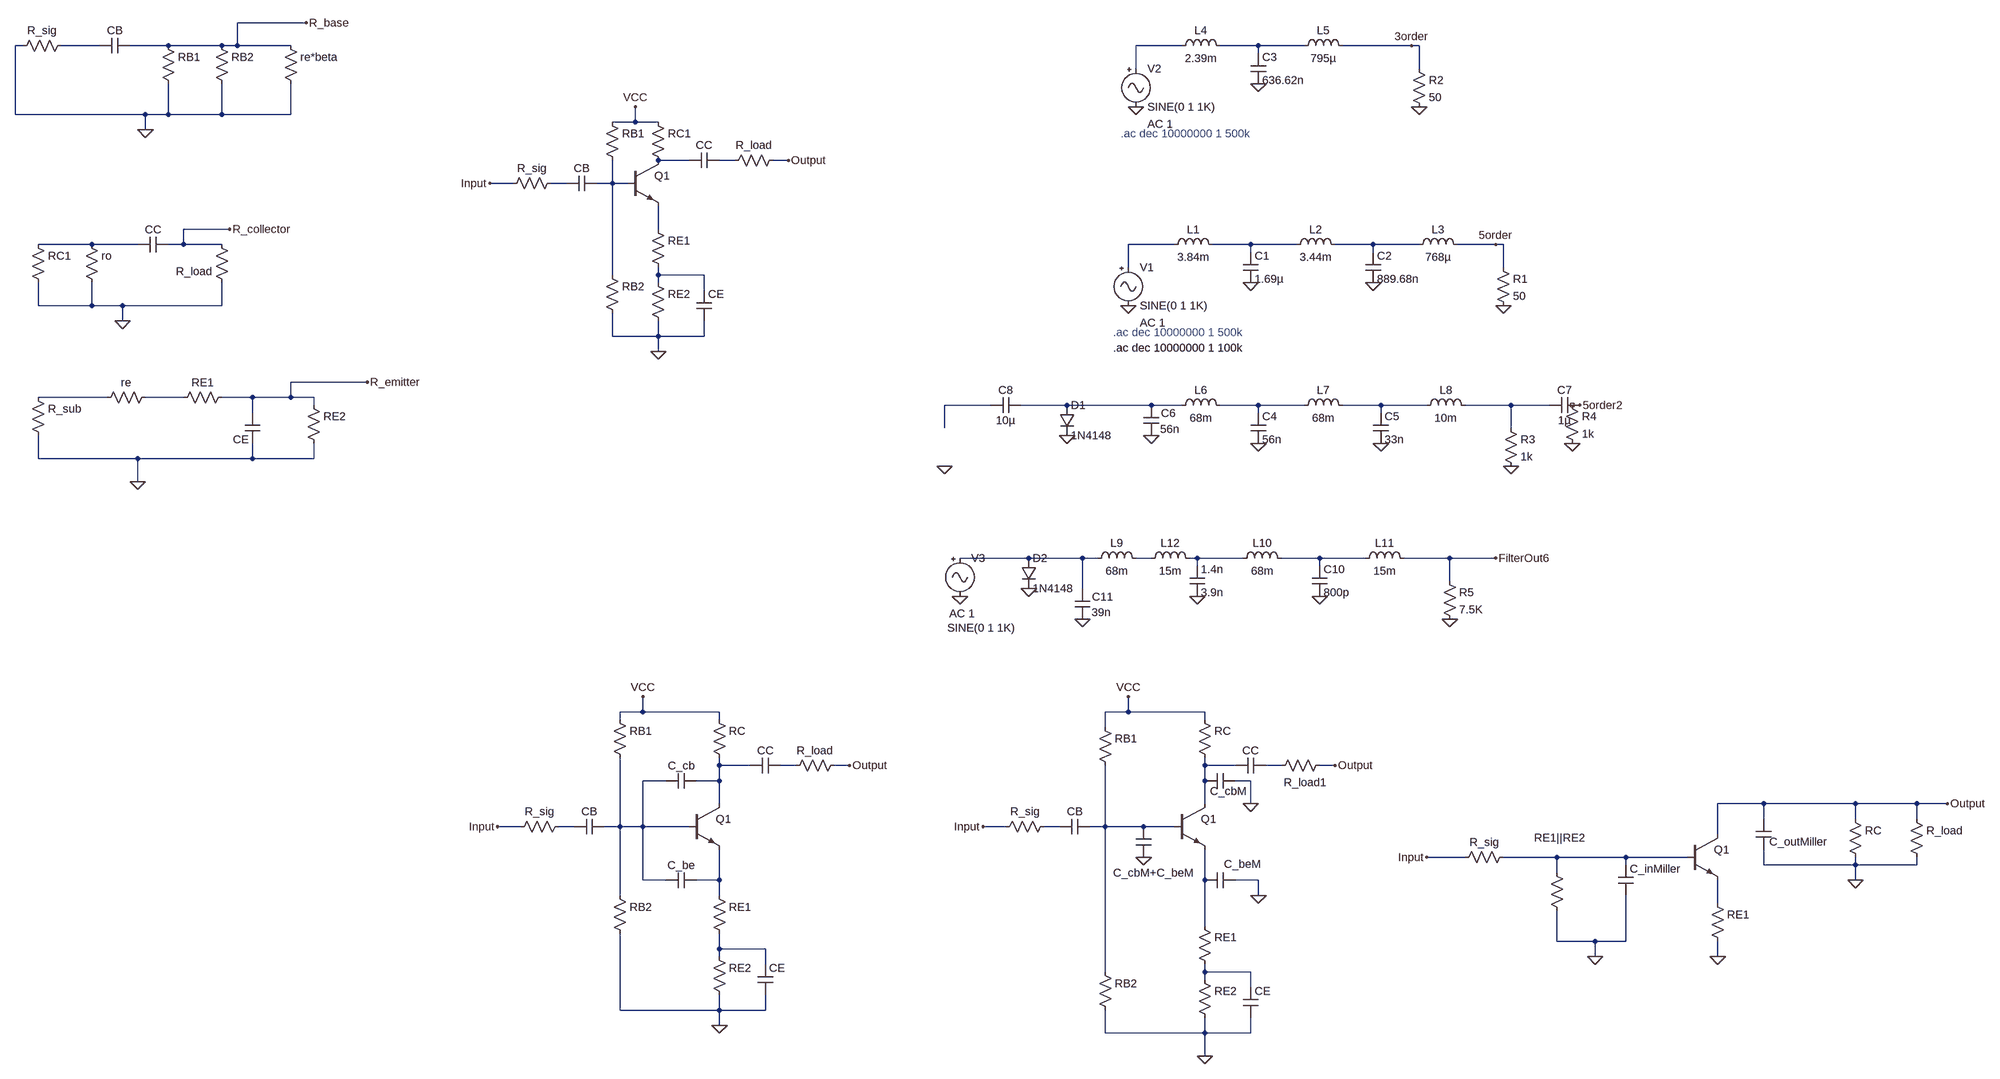
[diagram p0: schematic filtersForMixer.asc]
filtersForMixer.asc, the LTspice schematic file:
Version 4
SHEET 1 1812 1892
WIRE -1792 -320 -1936 -320
WIRE -2384 -272 -2400 -272
WIRE -2224 -272 -2304 -272
WIRE -2080 -272 -2160 -272
WIRE -1968 -272 -2080 -272
WIRE -1936 -272 -1936 -320
WIRE -1936 -272 -1968 -272
WIRE -1824 -272 -1936 -272
WIRE 112 -272 16 -272
WIRE 272 -272 192 -272
WIRE 368 -272 272 -272
WIRE 592 -272 448 -272
WIRE 608 -272 592 -272
WIRE 272 -256 272 -272
WIRE 16 -224 16 -272
WIRE 608 -224 608 -272
WIRE -2400 -128 -2400 -272
WIRE -2128 -128 -2400 -128
WIRE -2080 -128 -2080 -192
WIRE -2080 -128 -2128 -128
WIRE -1968 -128 -1968 -192
WIRE -1968 -128 -2080 -128
WIRE -1824 -128 -1824 -192
WIRE -1824 -128 -1968 -128
WIRE -1104 -112 -1104 -144
WIRE -1104 -112 -1152 -112
WIRE -1056 -112 -1104 -112
WIRE -2128 -96 -2128 -128
WIRE -992 -32 -1056 -32
WIRE -896 -32 -928 -32
WIRE -784 -32 -816 -32
WIRE -1360 16 -1408 16
WIRE -1248 16 -1280 16
WIRE -1152 16 -1152 -32
WIRE -1152 16 -1184 16
WIRE -1120 16 -1152 16
WIRE -1952 112 -2048 112
WIRE -1056 112 -1056 64
WIRE -2240 144 -2352 144
WIRE -2144 144 -2240 144
WIRE -2048 144 -2048 112
WIRE -2048 144 -2080 144
WIRE -1968 144 -2048 144
WIRE 96 144 0 144
WIRE 256 144 176 144
WIRE 352 144 256 144
WIRE 512 144 432 144
WIRE 608 144 512 144
WIRE 768 144 688 144
WIRE 784 144 768 144
WIRE 256 160 256 144
WIRE 512 160 512 144
WIRE 0 192 0 144
WIRE 784 192 784 144
WIRE -1152 208 -1152 16
WIRE -1056 208 -1056 192
WIRE -960 208 -1056 208
WIRE -1056 224 -1056 208
WIRE -960 240 -960 208
WIRE -2352 272 -2352 224
WIRE -2240 272 -2240 224
WIRE -2240 272 -2352 272
WIRE -2176 272 -2240 272
WIRE -1968 272 -1968 224
WIRE -1968 272 -2176 272
WIRE -2176 304 -2176 272
WIRE -1152 336 -1152 288
WIRE -1056 336 -1056 304
WIRE -1056 336 -1152 336
WIRE -960 336 -960 304
WIRE -960 336 -1056 336
WIRE -1056 368 -1056 336
WIRE -1664 432 -1824 432
WIRE -2208 464 -2352 464
WIRE -2048 464 -2128 464
WIRE -1904 464 -1968 464
WIRE -1824 464 -1824 432
WIRE -1824 464 -1904 464
WIRE -1776 464 -1824 464
WIRE -1776 480 -1776 464
WIRE -288 480 -384 480
WIRE -128 480 -224 480
WIRE 48 480 -128 480
WIRE 112 480 48 480
WIRE 272 480 192 480
WIRE 368 480 272 480
WIRE 528 480 448 480
WIRE 624 480 528 480
WIRE 800 480 704 480
WIRE 880 480 800 480
WIRE -1904 496 -1904 464
WIRE 272 496 272 480
WIRE 528 496 528 480
WIRE -384 528 -384 480
WIRE 800 528 800 480
WIRE -2352 592 -2352 544
WIRE -2144 592 -2352 592
WIRE -1904 592 -1904 560
WIRE -1904 592 -2144 592
WIRE -1776 592 -1776 560
WIRE -1776 592 -1904 592
WIRE -2144 640 -2144 592
WIRE -208 800 -352 800
WIRE -96 800 -208 800
WIRE -64 800 -96 800
WIRE 48 800 16 800
WIRE 144 800 128 800
WIRE 240 800 144 800
WIRE 400 800 320 800
WIRE 496 800 400 800
WIRE 672 800 576 800
WIRE 768 800 672 800
WIRE 144 816 144 800
WIRE 400 816 400 800
WIRE 672 848 672 800
WIRE -96 864 -96 800
WIRE -1088 1152 -1088 1120
WIRE -1088 1152 -1136 1152
WIRE -928 1152 -1088 1152
WIRE 0 1152 0 1120
WIRE 0 1152 -48 1152
WIRE 160 1152 0 1152
WIRE -1136 1168 -1136 1152
WIRE -928 1168 -928 1152
WIRE 160 1168 160 1152
WIRE -48 1184 -48 1152
WIRE -928 1264 -928 1248
WIRE -864 1264 -928 1264
WIRE -768 1264 -800 1264
WIRE -656 1264 -688 1264
WIRE 160 1264 160 1248
WIRE 224 1264 160 1264
WIRE 320 1264 288 1264
WIRE 432 1264 400 1264
WIRE -1040 1296 -1088 1296
WIRE -928 1296 -928 1264
WIRE -928 1296 -976 1296
WIRE 160 1296 160 1264
WIRE 256 1296 224 1296
WIRE -928 1344 -928 1296
WIRE 160 1344 160 1296
WIRE 256 1344 256 1296
WIRE 1328 1344 1232 1344
WIRE 1520 1344 1328 1344
WIRE 1648 1344 1520 1344
WIRE 1712 1344 1648 1344
WIRE 1328 1376 1328 1344
WIRE 1520 1376 1520 1344
WIRE 1648 1376 1648 1344
WIRE -1344 1392 -1392 1392
WIRE -1232 1392 -1264 1392
WIRE -1136 1392 -1136 1248
WIRE -1136 1392 -1168 1392
WIRE -1088 1392 -1088 1296
WIRE -1088 1392 -1136 1392
WIRE -992 1392 -1088 1392
WIRE -256 1392 -304 1392
WIRE -144 1392 -176 1392
WIRE -48 1392 -48 1264
WIRE -48 1392 -80 1392
WIRE 32 1392 -48 1392
WIRE 96 1392 32 1392
WIRE 1232 1408 1232 1344
WIRE 704 1456 624 1456
WIRE 896 1456 784 1456
WIRE 1040 1456 896 1456
WIRE 1168 1456 1040 1456
WIRE 1040 1472 1040 1456
WIRE 1328 1472 1328 1440
WIRE 1520 1472 1520 1456
WIRE 1520 1472 1328 1472
WIRE 1648 1472 1648 1456
WIRE 1648 1472 1520 1472
WIRE 896 1488 896 1456
WIRE -1088 1504 -1088 1392
WIRE -1040 1504 -1088 1504
WIRE -928 1504 -928 1440
WIRE -928 1504 -976 1504
WIRE 160 1504 160 1440
WIRE 272 1504 224 1504
WIRE 1520 1504 1520 1472
WIRE -1136 1536 -1136 1392
WIRE -928 1536 -928 1504
WIRE 272 1536 272 1504
WIRE 1232 1552 1232 1504
WIRE 160 1600 160 1504
WIRE 896 1632 896 1568
WIRE 976 1632 896 1632
WIRE 1040 1632 1040 1536
WIRE 1040 1632 976 1632
WIRE -928 1648 -928 1616
WIRE -832 1648 -928 1648
WIRE -928 1664 -928 1648
WIRE 976 1664 976 1632
WIRE 1232 1664 1232 1632
WIRE -832 1680 -832 1648
WIRE -48 1696 -48 1392
WIRE 160 1696 160 1680
WIRE 256 1696 160 1696
WIRE 160 1712 160 1696
WIRE 256 1728 256 1696
WIRE -1136 1776 -1136 1616
WIRE -928 1776 -928 1744
WIRE -928 1776 -1136 1776
WIRE -832 1776 -832 1744
WIRE -832 1776 -928 1776
WIRE -928 1808 -928 1776
WIRE -48 1824 -48 1776
WIRE 160 1824 160 1792
WIRE 160 1824 -48 1824
WIRE 256 1824 256 1792
WIRE 256 1824 160 1824
WIRE 160 1872 160 1824
FLAG 512 224 0
FLAG 256 224 0
FLAG 784 272 0
FLAG 0 272 0
FLAG 272 -192 0
FLAG 608 -144 0
FLAG 16 -144 0
FLAG 592 -272 3order
FLAG 768 144 5order
FLAG 528 560 0
FLAG 272 560 0
FLAG 928 560 0
FLAG 944 480 5order2
FLAG -128 544 0
FLAG 48 544 0
FLAG -384 608 0
FLAG 800 608 0
FLAG 768 800 FilterOut6
FLAG 400 880 0
FLAG 144 880 0
FLAG 672 928 0
FLAG -208 864 0
FLAG -352 880 0
FLAG -1104 -144 VCC
FLAG -784 -32 Output
FLAG -1408 16 Input
FLAG -1056 368 0
FLAG -1792 -320 R_base
FLAG -2176 304 0
FLAG -2128 -96 0
FLAG -1952 112 R_collector
FLAG -2144 640 0
FLAG -1664 432 R_emitter
FLAG -1088 1120 VCC
FLAG -656 1264 Output
FLAG -1392 1392 Input
FLAG -928 1808 0
FLAG 0 1120 VCC
FLAG 432 1264 Output
FLAG 32 1456 0
FLAG 272 1536 0
FLAG -304 1392 Input
FLAG 160 1872 0
FLAG 256 1344 0
FLAG 976 1664 0
FLAG 1520 1504 0
FLAG 1712 1344 Output
FLAG 624 1456 Input
FLAG 1232 1664 0
FLAG -96 928 0
SYMBOL ind 80 160 R270
WINDOW 0 32 56 VTop 2
WINDOW 3 5 56 VBottom 2
SYMATTR InstName L1
SYMATTR Value 3.84m
SYMBOL ind 336 160 R270
WINDOW 0 32 56 VTop 2
WINDOW 3 5 56 VBottom 2
SYMATTR InstName L2
SYMATTR Value 3.44m
SYMBOL cap 240 160 R0
SYMATTR InstName C1
SYMATTR Value 1.69µ
SYMBOL cap 496 160 R0
SYMATTR InstName C2
SYMATTR Value 889.68n
SYMBOL ind 592 160 R270
WINDOW 0 32 56 VTop 2
WINDOW 3 5 56 VBottom 2
SYMATTR InstName L3
SYMATTR Value 768µ
SYMBOL res 768 176 R0
SYMATTR InstName R1
SYMATTR Value 50
SYMBOL Misc\\signal 0 176 R0
WINDOW 123 24 132 Left 2
WINDOW 39 0 0 Left 0
SYMATTR Value2 AC 1
SYMATTR InstName V1
SYMBOL ind 96 -256 R270
WINDOW 0 32 56 VTop 2
WINDOW 3 5 56 VBottom 2
SYMATTR InstName L4
SYMATTR Value 2.39m
SYMBOL ind 352 -256 R270
WINDOW 0 32 56 VTop 2
WINDOW 3 5 56 VBottom 2
SYMATTR InstName L5
SYMATTR Value 795µ
SYMBOL cap 256 -256 R0
SYMATTR InstName C3
SYMATTR Value 636.62n
SYMBOL res 592 -240 R0
SYMATTR InstName R2
SYMATTR Value 50
SYMBOL Misc\\signal 16 -240 R0
WINDOW 123 24 132 Left 2
WINDOW 39 0 0 Left 0
SYMATTR Value2 AC 1
SYMATTR InstName V2
SYMBOL ind 96 496 R270
WINDOW 0 32 56 VTop 2
WINDOW 3 5 56 VBottom 2
SYMATTR InstName L6
SYMATTR Value 68m
SYMBOL ind 352 496 R270
WINDOW 0 32 56 VTop 2
WINDOW 3 5 56 VBottom 2
SYMATTR InstName L7
SYMATTR Value 68m
SYMBOL cap 256 496 R0
SYMATTR InstName C4
SYMATTR Value 56n
SYMBOL cap 512 496 R0
SYMATTR InstName C5
SYMATTR Value 33n
SYMBOL ind 608 496 R270
WINDOW 0 32 56 VTop 2
WINDOW 3 5 56 VBottom 2
SYMATTR InstName L8
SYMATTR Value 10m
SYMBOL res 784 512 R0
SYMATTR InstName R3
SYMATTR Value 1k
SYMBOL diode -144 480 R0
SYMATTR InstName D1
SYMATTR Value 1N4148
SYMBOL cap 32 480 R0
WINDOW 0 36 17 Left 2
WINDOW 3 35 50 Left 2
SYMATTR InstName C6
SYMATTR Value 56n
SYMBOL Misc\\signal -352 784 R0
WINDOW 123 -22 132 Left 2
WINDOW 39 0 0 Left 0
WINDOW 3 -26 162 Left 2
SYMATTR Value2 AC 1
SYMATTR InstName V3
SYMBOL cap 944 464 R90
WINDOW 0 0 32 VBottom 2
WINDOW 3 32 32 VTop 2
SYMATTR InstName C7
SYMATTR Value 1µ
SYMBOL res 912 464 R0
SYMATTR InstName R4
SYMATTR Value 1k
SYMBOL cap -224 464 R90
WINDOW 0 0 32 VBottom 2
WINDOW 3 32 32 VTop 2
SYMATTR InstName C8
SYMATTR Value 10µ
SYMBOL ind -80 816 R270
WINDOW 0 32 56 VTop 2
WINDOW 3 5 56 VBottom 2
SYMATTR InstName L9
SYMATTR Value 68m
SYMBOL ind 224 816 R270
WINDOW 0 32 56 VTop 2
WINDOW 3 5 56 VBottom 2
SYMATTR InstName L10
SYMATTR Value 68m
SYMBOL cap 128 816 R0
SYMATTR InstName 1.4n
SYMATTR Value 3.9n
SYMBOL cap 384 816 R0
SYMATTR InstName C10
SYMATTR Value 800p
SYMBOL ind 480 816 R270
WINDOW 0 32 56 VTop 2
WINDOW 3 5 56 VBottom 2
SYMATTR InstName L11
SYMATTR Value 15m
SYMBOL res 656 832 R0
SYMATTR InstName R5
SYMATTR Value 7.5K
SYMBOL diode -224 800 R0
SYMATTR InstName D2
SYMATTR Value 1N4148
SYMBOL cap -112 864 R0
WINDOW 0 36 17 Left 2
WINDOW 3 35 50 Left 2
SYMATTR InstName C11
SYMATTR Value 39n
SYMBOL npn -1120 -32 R0
SYMATTR InstName Q1
SYMATTR Value ""
SYMBOL res -1072 -128 R0
SYMATTR InstName RC1
SYMATTR Value ""
SYMBOL res -1168 -128 R0
SYMATTR InstName RB1
SYMATTR Value ""
SYMBOL cap -928 -48 R90
WINDOW 0 0 32 VBottom 2
WINDOW 3 32 32 VTop 2
SYMATTR InstName CC
SYMATTR Value ""
SYMBOL cap -1184 0 R90
WINDOW 0 0 32 VBottom 2
WINDOW 3 32 32 VTop 2
SYMATTR InstName CB
SYMATTR Value ""
SYMBOL res -1072 208 R0
SYMATTR InstName RE2
SYMATTR Value ""
SYMBOL res -1168 192 R0
SYMATTR InstName RB2
SYMATTR Value ""
SYMBOL cap -976 240 R0
SYMATTR InstName CE
SYMATTR Value ""
SYMBOL res -1072 96 R0
SYMATTR InstName RE1
SYMATTR Value ""
SYMBOL res -1264 0 R90
WINDOW 0 0 56 VBottom 2
WINDOW 3 32 56 VTop 2
SYMATTR InstName R_sig
SYMATTR Value ""
SYMBOL res -800 -48 R90
WINDOW 0 0 56 VBottom 2
WINDOW 3 32 56 VTop 2
SYMATTR InstName R_load
SYMATTR Value ""
SYMBOL res -2288 -288 R90
WINDOW 0 0 56 VBottom 2
WINDOW 3 32 56 VTop 2
SYMATTR InstName R_sig
SYMATTR Value ""
SYMBOL cap -2160 -288 R90
WINDOW 0 0 32 VBottom 2
WINDOW 3 32 32 VTop 2
SYMATTR InstName CB
SYMATTR Value ""
SYMBOL res -2096 -288 R0
SYMATTR InstName RB1
SYMATTR Value ""
SYMBOL res -1984 -288 R0
SYMATTR InstName RB2
SYMATTR Value ""
SYMBOL res -1840 -288 R0
SYMATTR InstName re*beta
SYMATTR Value ""
SYMBOL res -2368 128 R0
SYMATTR InstName RC1
SYMATTR Value ""
SYMBOL res -2256 128 R0
SYMATTR InstName ro
SYMATTR Value ""
SYMBOL cap -2080 128 R90
WINDOW 0 0 32 VBottom 2
WINDOW 3 32 32 VTop 2
SYMATTR InstName CC
SYMATTR Value ""
SYMBOL res -1952 240 R180
WINDOW 3 36 19 Left 2
SYMATTR Value ""
SYMATTR InstName R_load
SYMBOL res -2368 448 R0
SYMATTR InstName R_sub
SYMATTR Value ""
SYMBOL res -2112 448 R90
WINDOW 0 0 56 VBottom 2
WINDOW 3 32 56 VTop 2
SYMATTR InstName re
SYMATTR Value ""
SYMBOL res -2064 480 R270
WINDOW 0 32 56 VTop 2
WINDOW 3 0 56 VBottom 2
SYMATTR InstName RE1
SYMATTR Value ""
SYMBOL cap -1888 560 R180
WINDOW 3 24 -13 Left 2
SYMATTR Value ""
SYMATTR InstName CE
SYMBOL npn -992 1344 R0
SYMATTR InstName Q1
SYMATTR Value ""
SYMBOL res -944 1152 R0
SYMATTR InstName RC
SYMATTR Value ""
SYMBOL cap -800 1248 R90
WINDOW 0 0 32 VBottom 2
WINDOW 3 32 32 VTop 2
SYMATTR InstName CC
SYMATTR Value ""
SYMBOL cap -1168 1376 R90
WINDOW 0 0 32 VBottom 2
WINDOW 3 32 32 VTop 2
SYMATTR InstName CB
SYMATTR Value ""
SYMBOL res -944 1648 R0
SYMATTR InstName RE2
SYMATTR Value ""
SYMBOL res -1152 1520 R0
SYMATTR InstName RB2
SYMATTR Value ""
SYMBOL cap -848 1680 R0
SYMATTR InstName CE
SYMATTR Value ""
SYMBOL res -944 1520 R0
SYMATTR InstName RE1
SYMATTR Value ""
SYMBOL res -1248 1376 R90
WINDOW 0 0 56 VBottom 2
WINDOW 3 32 56 VTop 2
SYMATTR InstName R_sig
SYMATTR Value ""
SYMBOL res -672 1248 R90
WINDOW 0 0 56 VBottom 2
WINDOW 3 32 56 VTop 2
SYMATTR InstName R_load
SYMATTR Value ""
SYMBOL cap -976 1280 R90
WINDOW 0 0 32 VBottom 2
WINDOW 3 32 32 VTop 2
SYMATTR InstName C_cb
SYMATTR Value ""
SYMBOL cap -976 1488 R90
WINDOW 0 0 32 VBottom 2
WINDOW 3 32 32 VTop 2
SYMATTR InstName C_be
SYMATTR Value ""
SYMBOL res -1152 1152 R0
SYMATTR InstName RB1
SYMATTR Value ""
SYMBOL npn 96 1344 R0
SYMATTR InstName Q1
SYMATTR Value ""
SYMBOL res 144 1152 R0
SYMATTR InstName RC
SYMATTR Value ""
SYMBOL cap 288 1248 R90
WINDOW 0 0 32 VBottom 2
WINDOW 3 32 32 VTop 2
SYMATTR InstName CC
SYMATTR Value ""
SYMBOL cap -80 1376 R90
WINDOW 0 0 32 VBottom 2
WINDOW 3 32 32 VTop 2
SYMATTR InstName CB
SYMATTR Value ""
SYMBOL res 144 1696 R0
SYMATTR InstName RE2
SYMATTR Value ""
SYMBOL res -64 1680 R0
SYMATTR InstName RB2
SYMATTR Value ""
SYMBOL cap 240 1728 R0
SYMATTR InstName CE
SYMATTR Value ""
SYMBOL res 144 1584 R0
SYMATTR InstName RE1
SYMATTR Value ""
SYMBOL res -160 1376 R90
WINDOW 0 0 56 VBottom 2
WINDOW 3 32 56 VTop 2
SYMATTR InstName R_sig
SYMATTR Value ""
SYMBOL res 416 1248 R90
WINDOW 0 67 46 VBottom 2
WINDOW 3 32 56 VTop 2
SYMATTR InstName R_load1
SYMATTR Value ""
SYMBOL res -64 1168 R0
SYMATTR InstName RB1
SYMATTR Value ""
SYMBOL cap 16 1392 R0
WINDOW 0 -48 97 Left 2
SYMATTR InstName C_cbM+C_beM
SYMATTR Value ""
SYMBOL cap 224 1488 R90
WINDOW 0 -2 -15 VBottom 2
WINDOW 3 32 32 VTop 2
SYMATTR InstName C_beM
SYMATTR Value ""
SYMBOL cap 224 1280 R90
WINDOW 0 53 15 VBottom 2
WINDOW 3 32 32 VTop 2
SYMATTR InstName C_cbM
SYMATTR Value ""
SYMBOL res 800 1440 R90
WINDOW 0 0 56 VBottom 2
WINDOW 3 32 56 VTop 2
SYMATTR InstName R_sig
SYMATTR Value ""
SYMBOL res 912 1584 R180
WINDOW 0 -41 169 Left 2
WINDOW 3 36 40 Left 2
SYMATTR InstName RE1||RE2
SYMATTR Value ""
SYMBOL cap 1024 1472 R0
SYMATTR InstName C_inMiller
SYMATTR Value ""
SYMBOL npn 1168 1408 R0
SYMATTR InstName Q1
SYMATTR Value ""
SYMBOL res 1216 1536 R0
SYMATTR InstName RE1
SYMATTR Value ""
SYMBOL res 1632 1360 R0
SYMATTR InstName R_load
SYMATTR Value ""
SYMBOL cap 1312 1376 R0
WINDOW 0 28 48 Left 2
SYMATTR InstName C_outMiller
SYMATTR Value ""
SYMBOL res 1504 1360 R0
SYMATTR InstName RC
SYMATTR Value ""
SYMBOL res -1792 464 R0
SYMATTR InstName RE2
SYMATTR Value ""
SYMBOL ind 32 816 R270
WINDOW 0 32 56 VTop 2
WINDOW 3 5 56 VBottom 2
SYMATTR InstName L12
SYMATTR Value 15m
TEXT -32 328 Left 2 ;.ac dec 10000000 1 500k
TEXT -16 -88 Left 2 ;.ac dec 10000000 1 500k
TEXT -32 360 Left 2 !.ac dec 10000000 1 100k

The netlist it stands for:
* filtersForMixer.asc
L1 N010 N011 3.84m
L2 N011 N012 3.44m
C1 N011 0 1.69µ
C2 N012 0 889.68n
L3 N012 5order 768µ
R1 5order 0 50
V1 N010 0 SINE(0 1 1K) AC 1
L4 N002 N003 2.39m
L5 N003 3order 795µ
C3 N003 0 636.62n
R2 3order 0 50
V2 N002 0 SINE(0 1 1K) AC 1
L6 N017 N018 68m
L7 N018 N019 68m
C4 N018 0 56n
C5 N019 0 33n
L8 N019 N020 10m
R3 N020 0 1k
D1 N017 0 1N4148
C6 N017 0 56n
V3 N021 0 SINE(0 1 1K) AC 1
C7 5order2 N020 1µ
R4 NC_01 0 1k
C8 N017 N016 10µ
L9 N021 N022 68m
L10 N023 N024 68m
C§1.4n N023 0 3.9n
C10 N024 0 800p
L11 N024 FilterOut6 15m
R5 FilterOut6 0 7.5K
D2 N021 0 1N4148
C11 N021 0 39n
Q1 N004 N007 N008 0
RC1 VCC N004
RB1 VCC N007
CC N005 N004
CB N007 N006
RE2 N013 0
RB2 N007 0
CE N013 0
RE1 N008 N013
R_sig N006 Input
R_load Output N005
R_sig N001 0
CB R_base N001
RB1 R_base 0
RB2 R_base 0
re*beta R_base 0
RC1 N009 0
ro N009 0
CC R_collector N009
R_load 0 R_collector
R_sub N014 0
re N015 N014
RE1 N015 R_emitter
CE 0 R_emitter
Q1 N025 N029 N034 0
RC VCC N025
CC N026 N025
CB N029 N030
RE2 N037 0
RB2 N029 0
CE N037 0
RE1 N034 N037
R_sig N030 Input
R_load Output N026
C_cb N025 N029
C_be N034 N029
RB1 VCC N029
Q1 N027 N032 N035 0
RC VCC N027
CC N028 N027
CB N032 N031
RE2 N038 0
RB2 N032 0
CE N038 0
RE1 N035 N038
R_sig N031 Input
R_load1 Output N028
RB1 VCC N032
C_cbM+C_beM N032 0
C_beM 0 N035
C_cbM 0 N027
R_sig N033 Input
RE1||RE2 0 N033
C_inMiller N033 0
Q1 Output N033 N036 0
RE1 N036 0
R_load Output 0
C_outMiller Output 0
RC Output 0
RE2 R_emitter 0
L12 N022 N023 15m
.model D D
.lib standard.dio
.model NPN NPN
.model PNP PNP
.lib standard.bjt
* .ac dec 10000000 1 500k
* .ac dec 10000000 1 500k
.ac dec 10000000 1 100k
.backanno
.end